# EAGLE design ExenMiniBatteryShield (EAGLE 8.6.3)
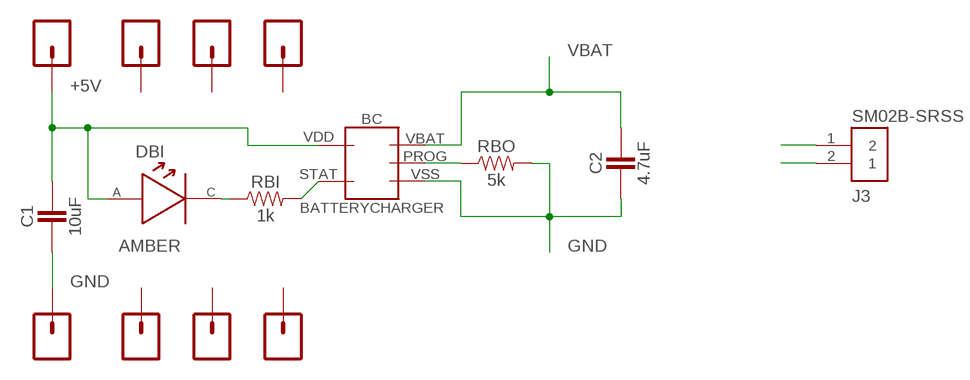
[diagram p0: schematic, sheet 1]

## Parts
+3.3  CONN_01PTH_NO_SILK_YES_STOP  [1X01_NO_SILK]
+5  CONN_01PTH_NO_SILK_YES_STOP  [1X01_NO_SILK]
A1  CONN_01PTH_NO_SILK_YES_STOP  [1X01_NO_SILK]
A2  CONN_01PTH_NO_SILK_YES_STOP  [1X01_NO_SILK]
BC  BATTERYCHARGER  [SOT-753]
C1  10uF  CAPACITOR  [PASSIVE-0603]
C2  4.7uF  CAPACITOR  [PASSIVE-0603]
DBI  AMBER  DIODE  [PASSIVE-0603]
GND  CONN_01PTH_NO_SILK_YES_STOP  [1X01_NO_SILK]
J3  SM02B-SRSS  AS-ITM-00231  [JST_SH_2X1]
RBI  1k  RESISTOR  [PASSIVE-0603]
RBO  5k  RESISTOR  [PASSIVE-0603]
RST  CONN_01PTH_NO_SILK_YES_STOP  [1X01_NO_SILK]
SCL  CONN_01PTH_NO_SILK_YES_STOP  [1X01_NO_SILK]
SDA  CONN_01PTH_NO_SILK_YES_STOP  [1X01_NO_SILK]

## Nets
+5V: +5.1 BC.VDD C1.2 DBI.1(ANODE)
GND: BC.VSS C1.1 C2.1 GND.1 J3.1 RBO.2
N$1: DBI.2(CATHODE) RBI.1
N$2: BC.STAT RBI.2
N$3: BC.PROG RBO.1
VBAT: BC.VBAT C2.2 J3.2
Unconnected: +3.3.1 A1.1 A2.1 RST.1 SCL.1 SDA.1

## Library data of the parts
+3.3 +5 A1 A2 GND RST SCL SDA = SparkFun-Connectors:CONN_01: Single connection point. Often used as Generic Header-pin footprint for 0.1 inch spaced/style header connections On any of the 0.1 inch spaced packages, you can populate with these: Break Away Headers - Straight <https://www.sparkfun.com/products/116> (PRT-00116) Break Away Male Headers - Right Angle <https://www.sparkfun.com/products/553> (PRT-00553) Female Headers <https://www.sparkfun.com/products/115> (PRT-00115) Break Away Headers - Machine Pin <https://www.sparkfun.com/products/117> (PRT-00117) Break Away Female Headers - Swiss Machine Pin <https://www.sparkfun.com/products/743> (PRT-00743) This device is also useful as a general connection point to wire up your design to another part of your project. Our various solder wires solder well into these plated through hole pads. Hook-Up Wire - Assortment (Stranded, 22 AWG) <https://www.sparkfun.com/products/11375> (PRT-11375) Hook-Up Wire - Assortment (Solid Core, 22 AWG) <https://www.sparkfun.com/products/11367> (PRT-11367) View the entire wire category on our website here <https://www.sparkfun.com/categories/141> Special notes: SMTSO-256-ET is a "flush mount" nut for a 4-40 screw. We mostly use this on specialty testbeds; it is a nice way to connect hardware to your PCB at an adjustable hieght. Also note, the SNAP packages are for using a snappable style connector. We sell a baggie of snaps and they are also used on two LilyPad designs: Snap Assortment - 30 pack (male and female) <https://www.sparkfun.com/products/11347> (DEV-11347) LilyPad Arduino SimpleSnap <https://www.sparkfun.com/products/10941> (DEV-10941) LilyPad SimpleSnap Protoboard <https://www.sparkfun.com/products/10940> (DEV-10940)
BC = ZippyComponentLibrary:BATTERYCHARGER: "Provides a soldering placement for a 3x2 right-angle header."
C1 C2 = ZippyComponentLibrary:CAPACITOR
DBI = ZippyComponentLibrary:DIODE: 2x1 SMD Diode Mounting Point
J3 = tinycircuits:AS-ITM-00231: CONN HEADER SH 2POS SIDE 1MM; PARTNO: AS-ITM-00231; PNPROTATION: 180; VALUE: SM02B-SRSS-TB(LF)(SN)
RBI RBO = ZippyComponentLibrary:RESISTOR

## Board
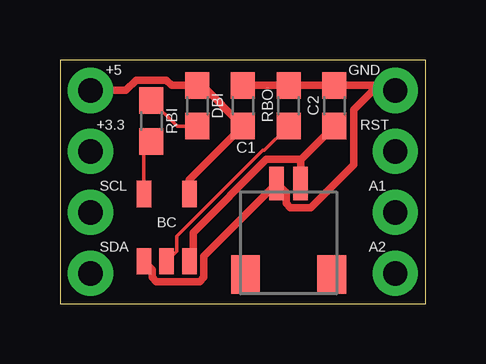
[diagram p1: board, top side]

Size 15.24 x 10.16 mm. Coordinates in mm from the lower left corner, seen from the top.
Outline: 0,0 15.24,0 15.24,10.16 0,10.16 0,0
Copper layers (1*16): Top 0.0356mm / dielectric 1.5011mm / Bottom 0.0356mm
Design rules "LaenPCBOrder *": minimum track width 6mil, minimum drill 13mil, track to track 6mil, track to pad 6mil, pad to pad 6mil, via to via 6mil, smd to smd 6mil, copper to edge 12mil, drill to drill 6mil, minimum pad ring 7mil, minimum via ring 7mil, stop-mask expansion 3mil, vias tented up to drill 0mil, thermal gap 10mil

### Footprints (pad centres in the part's own frame; a part is rotated, then mirrored left to right if it is on the bottom)
1X01_NO_SILK = drill 1.016 pad 1.88: 1 0,0
SOT-753 = smd 0.6 x 1.1: PROG 0,-1.4; STAT -0.95,1.4; VBAT 0.95,-1.4; VDD 0.95,1.4; VSS -0.95,-1.4
PASSIVE-0603 = smd 1.1 x 1: 1 -0.85,0; 2 0.85,0
JST_SH_2X1 = smd 0.6 x 1.4: 1 -0.5,2.475; 2 0.5,2.475 | smd 1.2 x 1.6: PAD1 -1.8,-1.325; PAD2 1.8,-1.325

### Placement (x,y rotation side)
+3.3  1.27,6.35 0 top
+5  1.27,8.89 0 top
A1  13.97,3.81 0 top
A2  13.97,1.27 0 top
BC  4.45,3.17 0 top
C1  7.62,8.26 270 top
C2  11.43,8.26 270 top
DBI  5.71,8.26 270 top
GND  13.97,8.89 0 top
J3  9.53,2.54 0 top
RBI  3.81,7.62 270 top
RBO  9.53,8.26 90 top
RST  13.97,6.35 0 top
SCL  1.27,3.81 0 top
SDA  1.27,1.27 0 top

### Tracks (layer width: path | path; a pad name or v marks a point on that pad's centre or on a via)
+5V
  Top 0.305: BC.VDD 5.39,5.18 C1.2 5.92,9.11 DBI.1 4.66,9.11 4.44,9.32 3.18,9.32 2.75,8.89 +5.1
GND
  Top 0.305: BC.VSS 3.84,1.43 3.84,1.1 4.02,0.92 5.82,0.92 6,1.1 6,1.99 J3.1 9.42,4.62 9.42,4.19 9.6,4.01 10.45,4.01 12.23,5.79 12.23,8.08 13.04,8.89 GND.1 13.76,9.11 C2.1 RBO.2 C1.1
N$1
  Top 0.152: RBI.1 4.88,7.41 DBI.2
N$2
  Top 0.152: RBI.2 3.5,6.46 BC.STAT
N$3
  Top 0.152: BC.PROG 4.87,2.2 4.87,2.83 8.44,6.4 8.52,6.4 RBO.1
VBAT
  Top 0.305: C2.2 10.04,6.02 | 10.04,6.02 10.03,6 J3.2 | BC.VBAT 5.54,1.92 5.54,2.96 8.6,6.02 10.04,6.02